# Altium schematic sheet ethernet.SchDoc: Ethernet
size A4; Organization: GPA Robotics; DocumentNumber: 3; Revision: REV 0; SheetNumber: 3; SheetTotal: 4
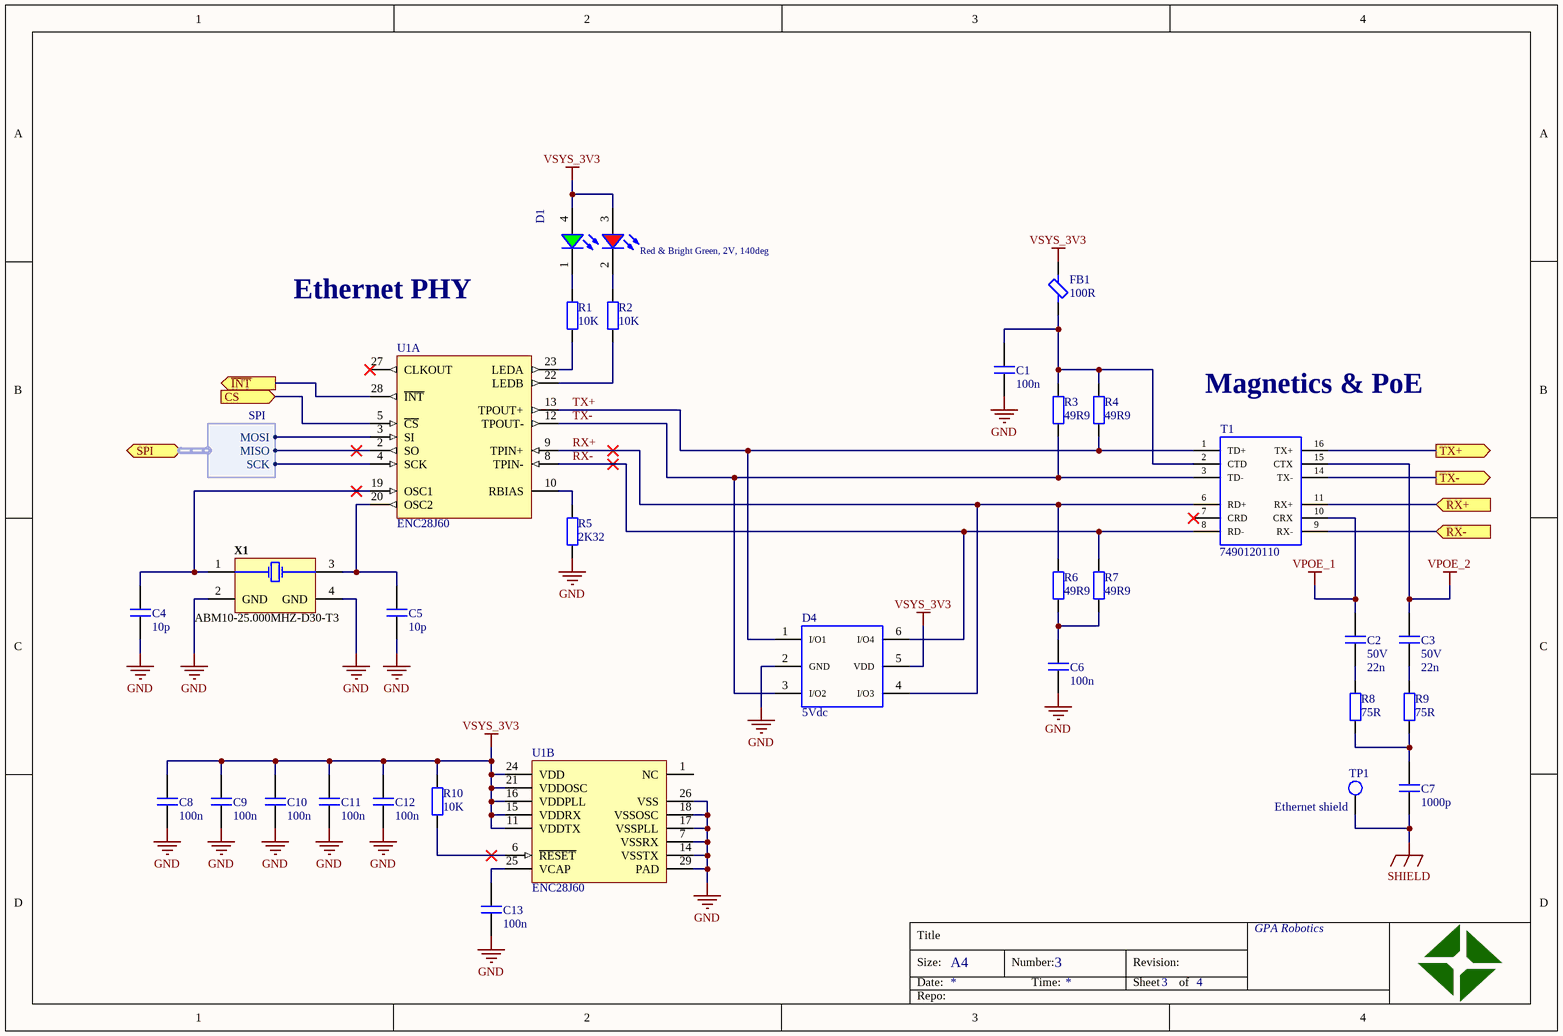
[diagram p0: ethernet.SchDoc]

## Parts
C1  value 100n  [CAPC1005X06N]  (hidden comment: cap)
C2  value 22n  voltage: 50V  [CAPC1005X06N]  (hidden comment: cap)
C3  value 22n  voltage: 50V  [CAPC1005X06N]  (hidden comment: cap)
C4  value 10p  [CAPC1005X06N]  (hidden comment: cap)
C5  value 10p  [CAPC1005X06N]  (hidden comment: cap)
C6  value 100n  [CAPC1005X06N]  (hidden comment: cap)
C7  value 1000p  [CAPC3216X14N]  (hidden comment: cap)
C8  value 100n  [CAPC1005X06N]  (hidden comment: cap)
C9  value 100n  [CAPC1005X06N]  (hidden comment: cap)
C10  value 100n  [CAPC1005X06N]  (hidden comment: cap)
C11  value 100n  [CAPC1005X06N]  (hidden comment: cap)
C12  value 100n  [CAPC1005X06N]  (hidden comment: cap)
C13  value 100n  [CAPC1005X06N]  (hidden comment: cap)
D1  Red & Bright Green, 2V, 140deg  [WL-SBCC_0603]
D4  5Vdc  [WE-TVS_SOT23-6L]
FB1  value 100R  [INDC1005X06N]  (hidden comment: ferrite)
R1  value 10K  [RESC1005X04N]  (hidden comment: res)
R2  value 10K  [RESC1005X04N]  (hidden comment: res)
R3  value 49R9  [RESC1005X04N]  (hidden comment: res)
R4  value 49R9  [RESC1005X04N]  (hidden comment: res)
R5  value 2K32  [RESC1005X04N]  (hidden comment: res)
R6  value 49R9  [RESC1005X04N]  (hidden comment: res)
R7  value 49R9  [RESC1005X04N]  (hidden comment: res)
R8  value 75R  [RESC1005X04N]  (hidden comment: res)
R9  value 75R  [RESC1005X04N]  (hidden comment: res)
R10  value 10K  [RESC1005X04N]  (hidden comment: res)
T1  7490120110  [7490120110]
TP1  Ethernet shield  [testpoint_tht_09mm]  (no BOM)
U1  ENC28J60  [QFN65P600X600X100_HS-29N-ENC28J60]  (parts A,B of 2)
X1  ABM10-25.000MHZ-D30-T3  [ABRA-ABM10_V]

## Ports
CS (in), RX+ (in), RX- (in), SPI (bidir, harness SPI), TX+ (out), TX- (out), ~{INT} (out)

## Harnesses
SPI: MOSI, MISO, SCK

## Nets
GND: C1.1 C4.1 C5.1 C6.1 C8.1 C9.1 C10.1 C11.1 C12.1 C13.1 D4.2(GND) R5.1 U1.7(VSSRX) U1.14(VSSTX) U1.17(VSSPLL) U1.18(VSSOSC) U1.26(VSS) U1.29(PAD) X1.2(GND) X1.4(GND)
SHIELD: C7.1 TP1.1
VPOE_1: C2.2 T1.10(CRX)
VPOE_2: C3.2 T1.15(CTX)
VSYS_3V3: C8.2 C9.2 C10.2 C11.2 C12.2 D1.3(A) D1.4(A) D4.5(VDD) FB1.2 R10.2 U1.11(VDDTX) U1.15(VDDRX) U1.16(VDDPLL) U1.21(VDDOSC) U1.24(VDD)
~{INT}: U1.28(~{INT}) ; port ~{INT}
CS: U1.5(~{CS}) ; port CS
RX+: D4.4(I/O3) R6.2 T1.6(RD+) U1.9(TPIN+)
RX+: T1.11(RX+) ; port RX+  [a separate net that carries the same name]
RX-: D4.6(I/O4) R7.2 T1.8(RD-) U1.8(TPIN-)
RX-: T1.9(RX-) ; port RX-  [a separate net that carries the same name]
TX+: D4.1(I/O1) R4.1 T1.1(TD+) U1.13(TPOUT+)
TX+: T1.16(TX+) ; port TX+  [a separate net that carries the same name]
TX-: D4.3(I/O2) R3.1 T1.3(TD-) U1.12(TPOUT-)
TX-: T1.14(TX-) ; port TX-  [a separate net that carries the same name]
NetC1_2: C1.2 FB1.1 R3.2 R4.2 T1.2(CTD)
NetC2_1: C2.1 R8.2
NetC3_1: C3.1 R9.2
NetC4_2: C4.2 U1.19(OSC1) X1.1(X1)
NetC5_2: C5.2 U1.20(OSC2) X1.3(X2)
NetC6_2: C6.2 R6.1 R7.1
NetC7_2: C7.2 R8.1 R9.1
NetC13_2: C13.2 U1.25(VCAP)
NetD1_1: D1.1(K) R1.2
NetD1_2: D1.2(K) R2.2
NetR1_1: R1.1 U1.23(LEDA)
NetR2_1: R2.1 U1.22(LEDB)
NetR5_2: R5.2 U1.10(RBIAS)
NetR10_1: R10.1 U1.6(~{RESET})
NetU1_2: U1.2(SO) ; port SPI.MISO
NetU1_3: U1.3(SI) ; port SPI.MOSI
NetU1_4: U1.4(SCK) ; port SPI.SCK

Not connected (* = marked no-connect by the designer): T1 7(CRD)*; U1 1(NC) 27(CLKOUT)*

## Notes on the sheet
- Ethernet PHY
- (near T1) Magnetics & PoE
- Title
- Size:
- Date:
- A4
- Number:
- Time:
- Revision:
- Sheet
- of
- Repo:

## Library data of the parts
C1-C6 C8-C13 = cap: Capacitor; type: *; #digikey: *; #mouser: *
  C1 C4-C6 C8-C13: voltage: *
C7 = cap: Capacitor; voltage: 2kV; type: *; #digikey: *; #mouser: *; Supplier 1: Digi-Key; Supplier Part Number 1: 311-4501-1-ND
D1 = 150060RV75240: WL-SBCC SMT Bi-color Chip LED Compact, size 0603, Red & Bright Green, 2V, 140deg; Peak Wavelength typ.: 630nm@Red, 572nm@Bright Green; Dominant Wavelength typ.: 625nm@Red, 570nm@Bright Green; Luminous Intensity typ.: 230mcd@Red, 90mcd@Bright Green; Chip Technology: AlInGaP; ComponentLink1Description: Manufacturer; ComponentLink1URL: http://www.we-online.de; ComponentLink2Description: Datasheet; ComponentLink2URL: https://katalog.we-online.de/led/datasheet/150060RV75240.pdf; Part Number: 150060RV75240; Published Date: June 2019; Publisher: Wurth Elektronik; Size: 0603; Forward Voltage typ.: 2V; Viewing Angle typ.: 140deg; Operating Temperature: -40 to +85degC; Emitting Color: Red & Bright Green; Mounting Technology: SMT; Packaging: Tape and Reel
D4 = 824015: WE-TVS TVS Diode - High Speed Series, SOT23-6L, 4+1Channel, 5Vdc; Manufacturer: Wurth Elektronik; Reverse Breakdown Voltage min.: 6.1V; Channel: 4+1; Channel Input Capacitance: 2pF; Reverse Peak Pulse Current: 12A; Reverse Channel Leakage Current: 2uA; DC Operating Voltage: 5V; ComponentLink1Description: Manufacturer; ComponentLink1URL: http://www.we-online.de; ComponentLink2Description: Datasheet; ComponentLink2URL: https://www.we-online.com/catalog/datasheet/824015.pdf; Manufacturer Part Number: 824015; Published Date: April 2020; Size: SOT23-6L; Operating Temperature: -40 to +125degC; Mounting Technology: SMT; Packaging: Tape and Reel
FB1 = ferrite: Inductor; #digikey: *; #mouser: *
R1-R10 = res: Resistor; power: *; voltage: *; #digikey: *; #mouser: *
T1 = 7490120110: WE-LAN LAN Transformer, SMT, 10/100 Base-T, 1 port; Manufacturer: Wurth Elektronik; PoE Current: 720mA; Turns Ratio: 1:1; HPLE: No; Number of Ports: 1; Inductance: 120uH; Insulation Test Voltage: 1500Vrms; ComponentLink1Description: Manufacturer; ComponentLink1URL: http://www.we-online.de; ComponentLink2Description: Datasheet; ComponentLink2URL: https://www.we-online.com/catalog/datasheet/7490120110.pdf; Operating Temperature: -40 to +85degC; Published Date: March 2020; Manufacturer Part Number: 7490120110; Packaging: Tape and Reel; Data Rate: 10/100 Base-T; Mounting Technology: SMT
TP1 = testpoint: Test point; testpoint: .Comment; #digikey: *; #mouser: *
U1 = enc28j60-iml: Stand-Alone Ethernet Controller with SPI Interface; ComponentLink1Description: Datasheet; ComponentLink1URL: http://ww1.microchip.com/downloads/en/DeviceDoc/39662e.pdf
X1 = CMP-2000-05727-1: Ceramic SMD Ultra Miniature Quartz Crystal, 25 MHz, 100 Ohm, 10 pF, -40 to 85 degC, 4-Pin SMD, RoHS, Tape and Reel; Manufacturer: ABRACON; Case Width: 2mm; Case Length: 2.5mm; Frequency: 25MHz; ESR: 100Ohms; Load Capacitance: 10pF; Case Height: 0.5mm; Tolerance: 20PPM; Frequency Stability: 30PPM; Manufacturer URL: http://www.abracon.com/; Datasheet URL: https://datasheet.ciiva.com/4946/abm10-31166-4946144.pdf; Type: UltraMiniatureQuartzCrystal; Series: ABM10; Mounting Style: SMD/SMT; Operating Temperature Range: -40Cto+85C; Mounting Technology: SurfaceMount; Factory Pack Quantity: 3000; Datasheet Version: 01/2013; Packaging: Reel; Brand: ABRACON; Package Description: 4-Pin Surface Mount Device, Body 2 x 2.5 mm, Pitch 1.65 mm; Termination Style: SMD/SMT; Product Category: Crystals; Package / Case: 2.5mmx2mmx0.5mm; Dimensions: 2mmWx2.5mmLx0.5mmH; RoHS: Details; Package Reference: ABM10